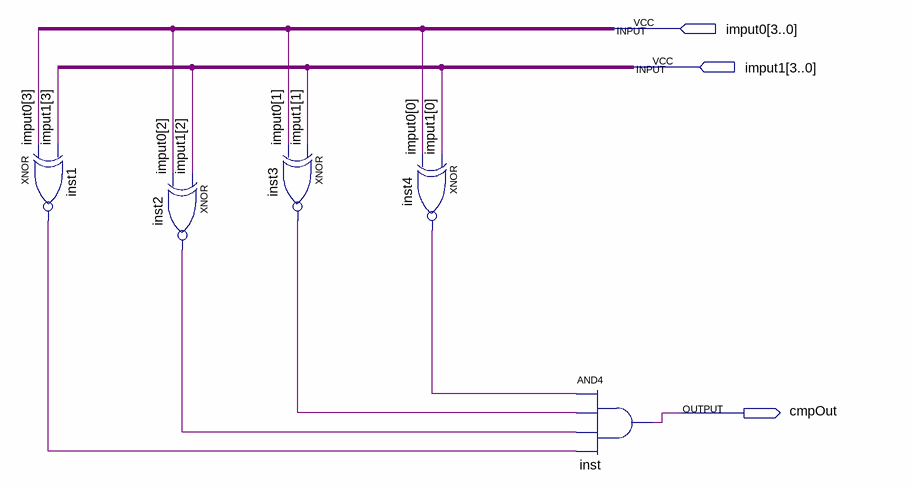
[diagram p0: schematic sheet]
// Quartus schematic EqCmp4.bdf as structural Verilog: 5 symbols, 3 pins
module EqCmp4 (
  input  [3:0] imput0,
  input  [3:0] imput1,
  output cmpOut
);

  wire inst1_out, inst2_out, inst3_out, inst4_out;

  xnor inst1 (inst1_out, imput0[3], imput1[3]);
  xnor inst2 (inst2_out, imput1[2], imput0[2]);
  xnor inst3 (inst3_out, imput1[1], imput0[1]);
  xnor inst4 (inst4_out, imput1[0], imput0[0]);
  and inst (cmpOut, inst4_out, inst3_out, inst2_out, inst1_out);
endmodule
